# Altium project fryquency.PrjPcb
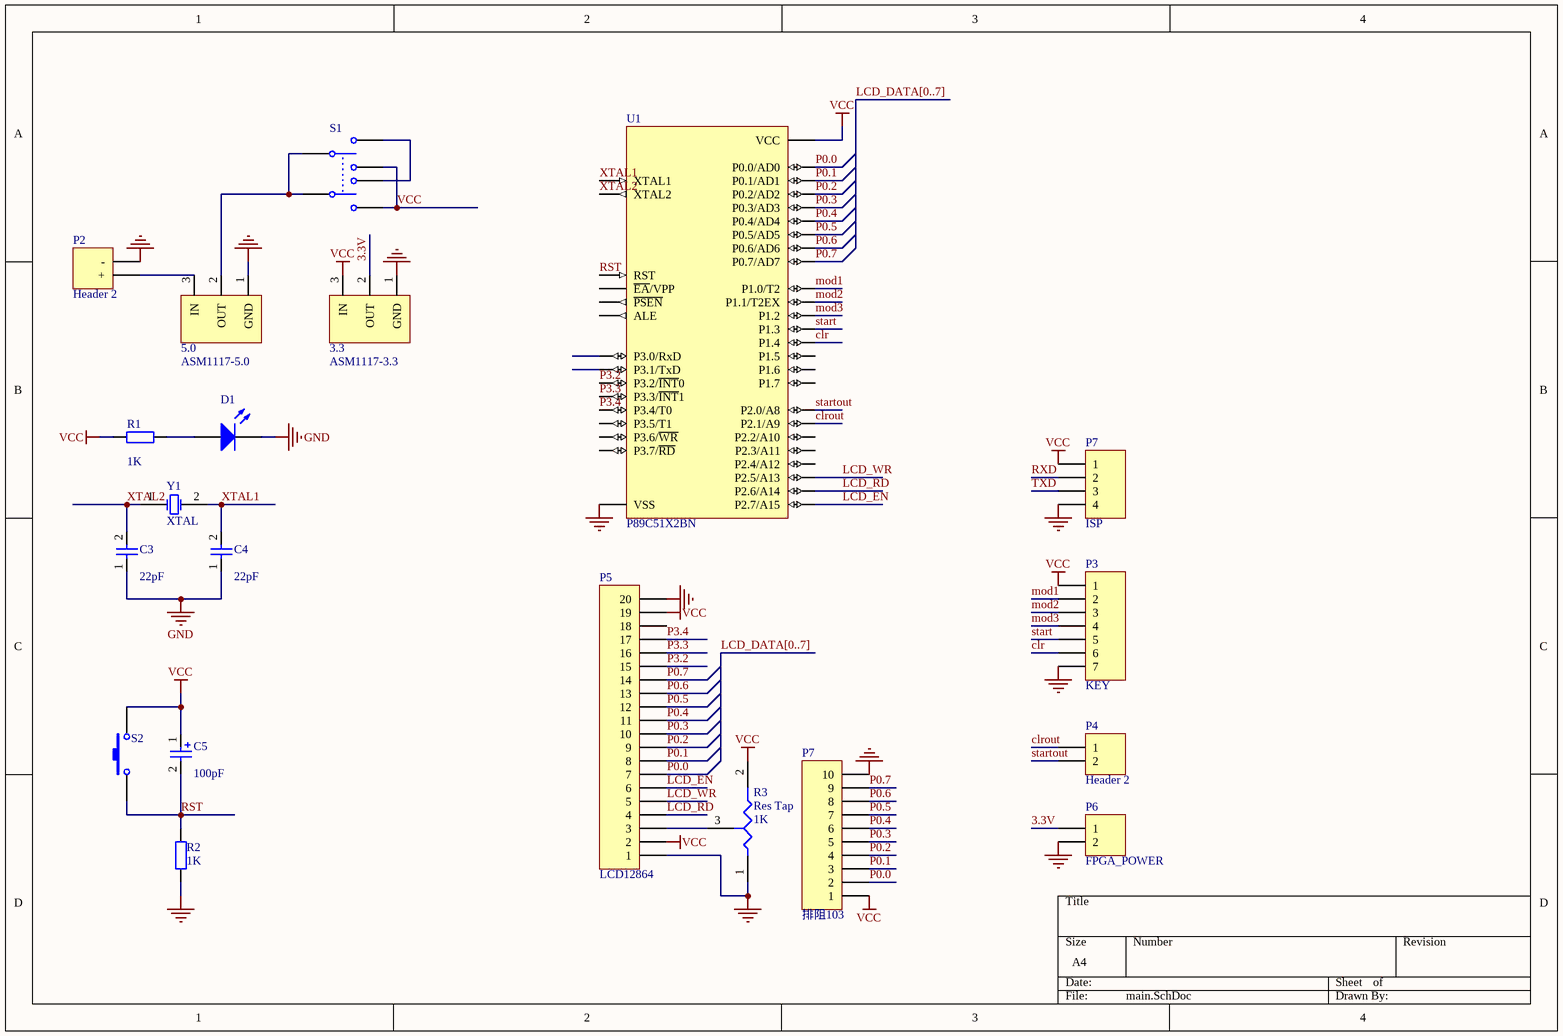
[diagram p0: main.SchDoc]
1 sheet, 20 parts. Net scope: global (net labels, ports and power ports of the same name join across sheets).
Board files: PCB1.PcbDoc, PCB2.PcbDoc, PCB3.PcbDoc

## Sheet main.SchDoc
size A4

### Parts
(Parts that share a designator on the sheet are numbered #1, #2 ... from top to bottom, then left to right.)
3.3  ASM1117-3.3  [SOT223]
5.0  ASM1117-5.0  [SOT223]
C3  value 22pF  [HDR1X2]  (hidden comment: Cap)
C4  value 22pF  [HDR1X2]  (hidden comment: Cap)
C5  value 100pF  [HDR1X2]  (hidden comment: Cap Pol2)
D1  LED1  [CB1]  (value not drawn)
P2  Header 2  [接线端子2P]
P3  KEY  [HDR1X7]
P4  Header 2  [HDR1X2]
P5  LCD12864  [HDR1X20]
P6  FPGA_POWER  [HDR1X2]
P7#1  ISP  [HDR1X4]
P7#2  排阻103  [HDR1X10]
R1  value 1K  [AXIAL-0.4]  (hidden comment: Res2)
R2  value 1K  [AXIAL-0.4]  (hidden comment: Res2)
R3  Res Tap  value 1K  [SOT-23]
S1  SW-DPDT  [AN88]  (value not drawn)
S2  SW-PB  [AN66]  (value not drawn)
U1  P89C51X2BN  [DIP40]
Y1  XTAL  [AXIAL0.4]

### Nets
GND: 3.3.1(GND) 5.0.1(GND) C3.1 C4.1 D1.2(K) P2.2(-) P3.7 P5.1 P5.20 P6.2 P7#1.4 P7#2.10 R2.1 R3.1(A) U1.20(VSS)
VCC: 3.3.3(IN) C5.1 P3.1 P5.2 P5.19 P7#1.1 P7#2.1 R1.1 R3.2(B) S1.3 S1.6 S2.2 U1.40(VCC)
3.3V: 3.3.2(OUT) P6.1
clr: P3.6 U1.5(P1.4)
clrout: P4.1 U1.22(P2.1/A9)
LCD_EN: P5.6 U1.28(P2.7/A15)
LCD_RD: P5.4 U1.27(P2.6/A14)
LCD_WR: P5.5 U1.26(P2.5/A13)
mod1: P3.2 U1.1(P1.0/T2)
mod2: P3.3 U1.2(P1.1/T2EX)
mod3: P3.4 U1.3(P1.2)
P0.0: P5.7 P7#2.2 U1.39(P0.0/AD0)
P0.1: P5.8 P7#2.3 U1.38(P0.1/AD1)
P0.2: P5.9 P7#2.4 U1.37(P0.2/AD2)
P0.3: P5.10 P7#2.5 U1.36(P0.3/AD3)
P0.4: P5.11 P7#2.6 U1.35(P0.4/AD4)
P0.5: P5.12 P7#2.7 U1.34(P0.5/AD5)
P0.6: P5.13 P7#2.8 U1.33(P0.6/AD6)
P0.7: P5.14 P7#2.9 U1.32(P0.7/AD7)
P3.2: P5.15 U1.12(P3.2/~{INT}0)
P3.3: P5.16 U1.13(P3.3/~{INT}1)
P3.4: P5.17 U1.14(P3.4/T0)
RST: C5.2 R2.2 S2.1 U1.9(RST)
RXD: P7#1.2
start: P3.5 U1.4(P1.3)
startout: P4.2 U1.21(P2.0/A8)
TXD: P7#1.3
XTAL1: C4.2 U1.19(XTAL1) Y1.2(OSC2)
XTAL2: C3.2 U1.18(XTAL2) Y1.1(OSC1)
Net5.0_2: 5.0.2(OUT) S1.1 S1.4
Net5.0_3: 5.0.3(IN) P2.1(+)
NetD1_1: D1.1(A) R1.2
NetP5_3: P5.3 R3.3(TAP)
NetS1_2: S1.2 S1.5

Not connected (* = marked no-connect by the designer): P5 18; U1 6(P1.5) 7(P1.6) 8(P1.7) 10(P3.0/RxD) 11(P3.1/TxD) 15(P3.5/T1) 16(P3.6/~{WR}) 17(P3.7/~{RD}) 23(P2.2/A10) 24(P2.3/A11) 25(P2.4/A12) 29(~{PSEN}) 30(ALE) 31(~{EA}/VPP)

### Buses and harness runs
bus LCD_DATA[0..7]

### Library data of the parts
3.3 5.0 = ASM1117
C3 C4 = Cap: Capacitor; Published: 8-Jun-2000; LatestRevisionDate: 17-Jul-2002; LatestRevisionNote: Re-released for DXP Platform.; PackageReference: RAD-0.3; Publisher: Altium Limited; PackageDescription: Radial Cap, Thru-Hole; 2 Leads; 0.3 in Pin Spacing
C5 = Cap Pol2: Polarized Capacitor (Axial); Published: 8-Jun-2000; LatestRevisionDate: 17-Jul-2002; LatestRevisionNote: Re-released for DXP Platform.; PackageReference: POLAR0.8; Publisher: Altium Limited; PackageDescription: Polarized Capacitor; 2 Leads
D1 = LED1: Typical RED GaAs LED; Published: 8-Jun-2000; LatestRevisionDate: 08-Jul-2005; LatestRevisionNote: Mech Layer 1 removed.; PackageReference: LED-1; Publisher: Altium Limited; PackageDescription: LED; 2 Leads
P2 P4 P6 = Header 2: Header, 2-Pin; LatestRevisionDate: 17-Jul-2002; LatestRevisionNote: Re-released for DXP Platform.; Publisher: Altium Limited
P3 = Header 7: Header, 7-Pin; LatestRevisionDate: 17-Jul-2002; LatestRevisionNote: Re-released for DXP Platform.; Publisher: Altium Limited
P5 = Header 20: Header, 20-Pin; LatestRevisionDate: 17-Jul-2002; LatestRevisionNote: Re-released for DXP Platform.; Publisher: Altium Limited
P7#1 = Header 4: Header, 4-Pin; LatestRevisionDate: 17-Jul-2002; LatestRevisionNote: Re-released for DXP Platform.; Publisher: Altium Limited
P7#2 = Header 10: Header, 10-Pin; LatestRevisionDate: 17-Jul-2002; LatestRevisionNote: Re-released for DXP Platform.; Publisher: Altium Limited
R1 R2 = Res2: Resistor; Published: 8-Jun-2000; LatestRevisionDate: 17-Jul-2002; LatestRevisionNote: Re-released for DXP Platform.; PackageReference: AXIAL-0.4; Publisher: Altium Limited; PackageDescription: Axial Device, Thru-Hole; 2 Leads; 0.4 in Pin Spacing
R3 = Res Tap: Tapped Resistor; Sim Note: Enter the Resistance value and the set point into parameter fields.; Set Position: 0.5; Published: 24-Mar-1999; LatestRevisionDate: 17-Jul-2002; LatestRevisionNote: Re-released for DXP Platform.; PackageReference: VR3; Publisher: Altium Limited; PackageDescription: Variable Resistor, Thru-Hole; 3 Leads
S1 = SW-DPDT: Double-Pole, Double-Throw Switch; Published: 24-Mar-1999; LatestRevisionDate: 17-Jul-2002; LatestRevisionNote: Re-released for DXP Platform.; PackageReference: DPDT-6; Publisher: Altium Limited; PackageDescription: Switch; 6 Leads
S2 = SW-PB: Switch; Published: 24-Mar-1999; LatestRevisionDate: 17-Jul-2002; LatestRevisionNote: Re-released for DXP Platform.; PackageReference: SPST-2; Publisher: Altium Limited; PackageDescription: Switch; 2 Leads
U1 = P89C51X2BN: 80C51 8-Bit Flash Microcontroller Family, 4 kB Flash; Published: 21-May-2003; DatasheetDocument: 5-Jun-2002; PackageDocument: 07-Aug-2000; PackageReference: SOT129-1; Publisher: Altium Limited; Code_JEDEC: MO-015
Y1 = XTAL: Crystal Oscillator; Published: 8-Jun-2000; LatestRevisionDate: 17-Jul-2002; LatestRevisionNote: Re-released for DXP Platform.; PackageReference: R38; Publisher: Altium Limited; PackageDescription: Crystal, Thru-Hole; 2 Leads; Body 3.1 x 8.2 mm (Dia.xH)